# EAGLE design mk-logic-bt (EAGLE 6.0)

## Sheet 1 of 3
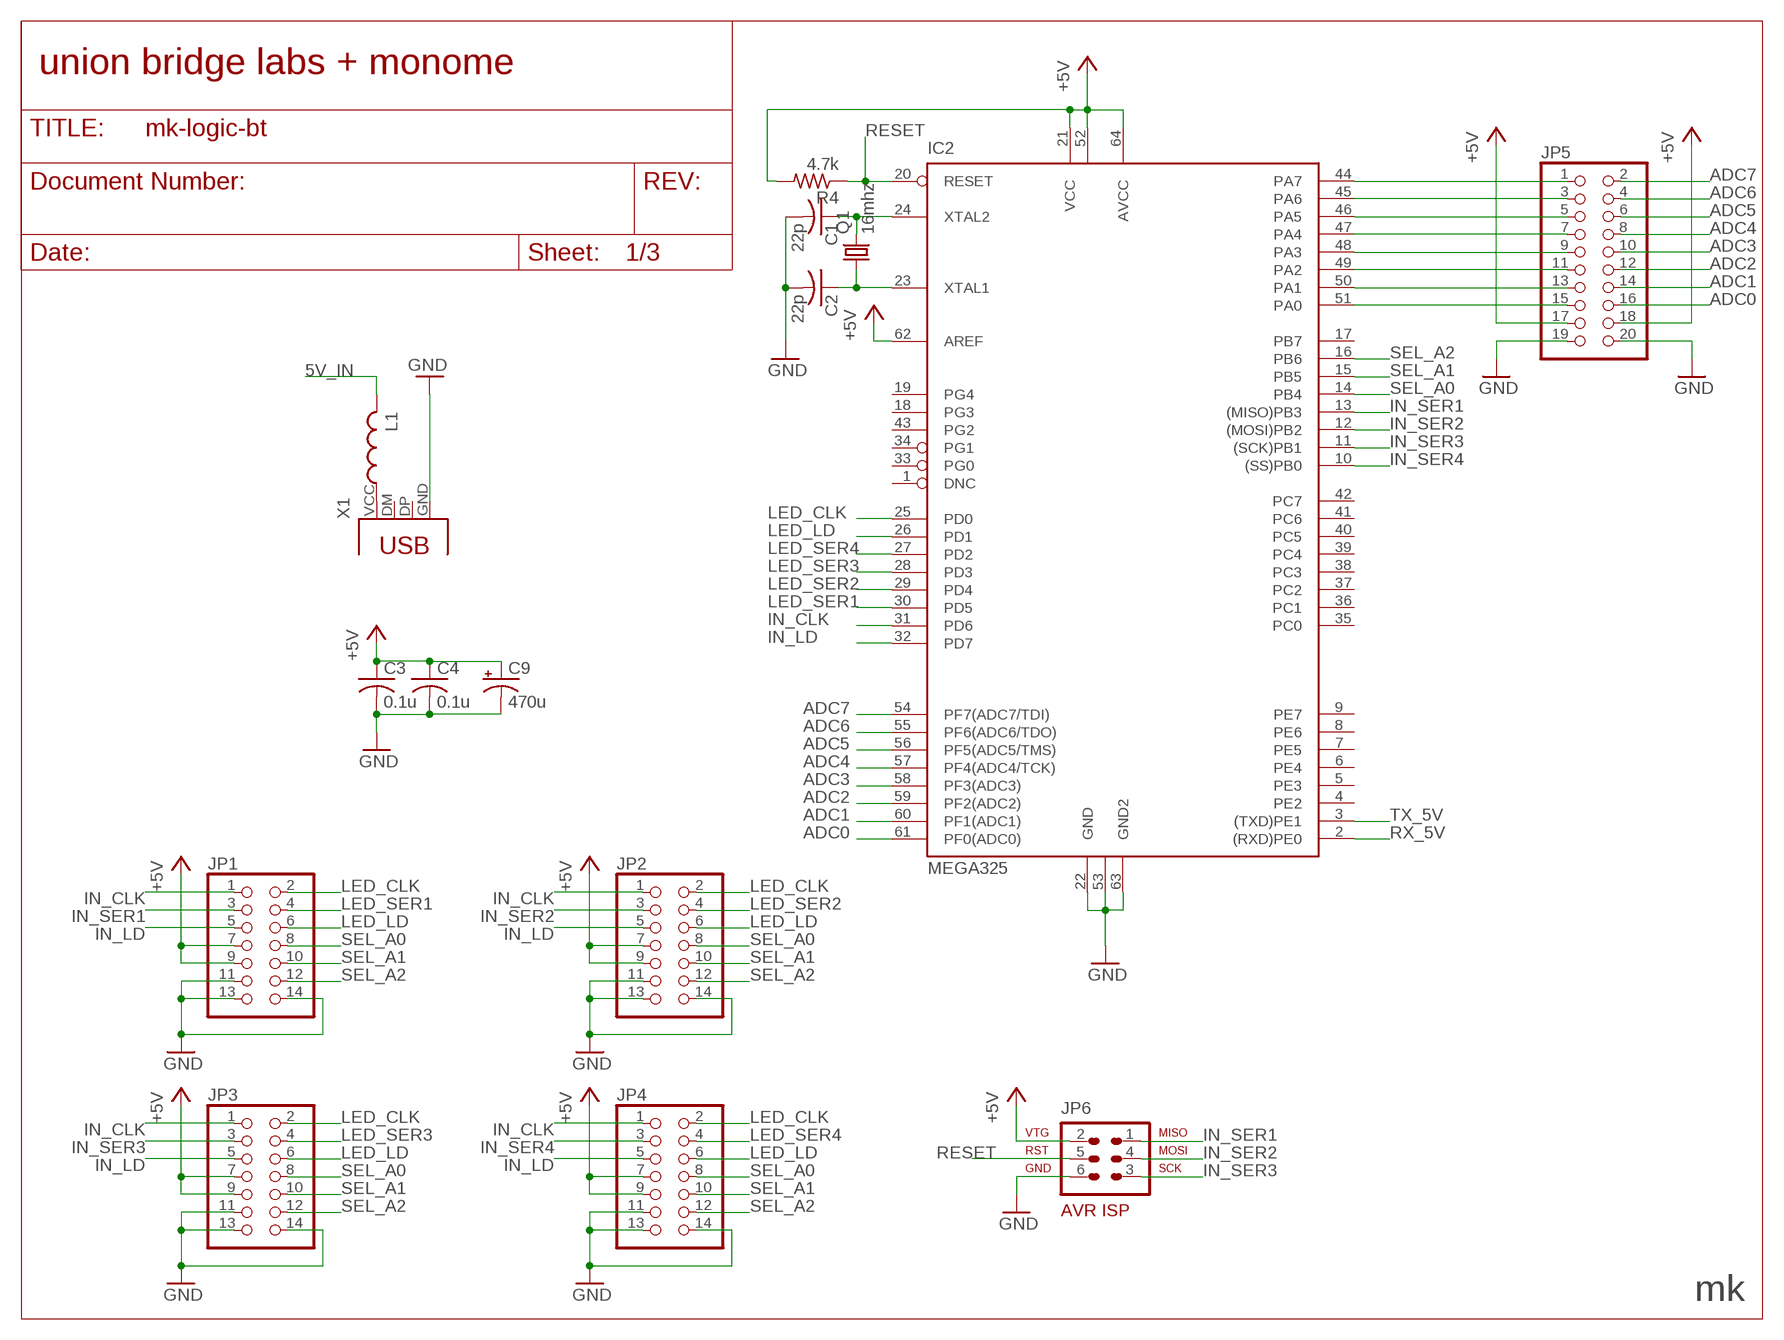
[diagram p0: schematic, sheet 1]

### Parts
C1  22p  C-USC1206  [C1206]
C2  22p  C-USC1206  [C1206]
C3  0.1u  C-USC1206  [C1206]
C4  0.1u  C-USC1206  [C1206]
C9  470u  CPOL-USE  [PANASONIC_E]
IC2  MEGA325  [TQFP64]
JP1  PINHD-2X7  [2X07]
JP2  PINHD-2X7  [2X07]
JP3  PINHD-2X7  [2X07]
JP4  PINHD-2X7  [2X07]
JP5  PINHD-2X10  [2X10]
JP6  AVR-ISP  AVR-ISP-6  [AVR-ISP-6]
L1  L-USL3216C  [L3216C]
Q1  16mhz  CRYTALHC49UP  [HC49UP]
R4  4.7k  R-US_R1206  [R1206]
X1  USB_TYPE_B  [USB_B]

### Nets
5V_IN: L1.2 ; also sheet 3
+5V: C3.1 C4.1 C9.+ IC2.21(VCC) IC2.52(VCC1) IC2.62(AREF) IC2.64(AVCC) JP1.7 JP1.9 JP2.7 JP2.9 JP3.7 JP3.9 JP4.7 JP4.9 JP5.17 JP5.18 JP6.2 R4.2 ; also sheet 2,3
ADC0: IC2.61(PF0(ADC0)) JP5.16
ADC1: IC2.60(PF1(ADC1)) JP5.14
ADC2: IC2.59(PF2(ADC2)) JP5.12
ADC3: IC2.58(PF3(ADC3)) JP5.10
ADC4: IC2.57(PF4(ADC4/TCK)) JP5.8
ADC5: IC2.56(PF5(ADC5/TMS)) JP5.6
ADC6: IC2.55(PF6(ADC6/TDO)) JP5.4
ADC7: IC2.54(PF7(ADC7/TDI)) JP5.2
GND: C1.2 C2.2 C3.2 C4.2 C9.- IC2.22(GND) IC2.53(GND1) IC2.63(GND2) JP1.11 JP1.13 JP1.14 JP2.11 JP2.13 JP2.14 JP3.11 JP3.13 JP3.14 JP4.11 JP4.13 JP4.14 JP5.19 JP5.20 JP6.6 X1.GND ; also sheet 2,3
IN_CLK: IC2.31(PD6) JP1.1 JP2.1 JP3.1 JP4.1
IN_LD: IC2.32(PD7) JP1.5 JP2.5 JP3.5 JP4.5
IN_SER1: IC2.13((MISO)PB3) JP1.3 JP6.1
IN_SER2: IC2.12((MOSI)PB2) JP2.3 JP6.4
IN_SER3: IC2.11((SCK)PB1) JP3.3 JP6.3
IN_SER4: IC2.10((SS)PB0) JP4.3
LED_CLK: IC2.25(PD0) JP1.2 JP2.2 JP3.2 JP4.2
LED_LD: IC2.26(PD1) JP1.6 JP2.6 JP3.6 JP4.6
LED_SER1: IC2.30(PD5) JP1.4
LED_SER2: IC2.29(PD4) JP2.4
LED_SER3: IC2.28(PD3) JP3.4
LED_SER4: IC2.27(PD2) JP4.4
N$4: IC2.44(PA7) JP5.1
N$5: IC2.45(PA6) JP5.3
N$6: IC2.46(PA5) JP5.5
N$7: IC2.47(PA4) JP5.7
N$8: C2.1 IC2.23(XTAL1) Q1.1
N$9: C1.1 IC2.24(XTAL2) Q1.2
N$10: IC2.48(PA3) JP5.9
N$11: IC2.49(PA2) JP5.11
N$12: L1.1 X1.VCC
N$23: IC2.50(PA1) JP5.13
N$24: IC2.51(PA0) JP5.15
RESET: IC2.20(RESET) JP6.5 R4.1
RX_5V: IC2.2((RXD)PE0) ; also sheet 2
SEL_A0: IC2.14(PB4) JP1.8 JP2.8 JP3.8 JP4.8
SEL_A1: IC2.15(PB5) JP1.10 JP2.10 JP3.10 JP4.10
SEL_A2: IC2.16(PB6) JP1.12 JP2.12 JP3.12 JP4.12
TX_5V: IC2.3((TXD)PE1) ; also sheet 2
Unconnected: IC2.1(DNC) IC2.4(PE2) IC2.5(PE3) IC2.6(PE4) IC2.7(PE5) IC2.8(PE6) IC2.9(PE7) IC2.17(PB7) IC2.18(PG3) IC2.19(PG4) IC2.33(PG0) IC2.34(PG1) IC2.35(PC0) IC2.36(PC1) IC2.37(PC2) IC2.38(PC3) IC2.39(PC4) IC2.40(PC5) IC2.41(PC6) IC2.42(PC7) IC2.43(PG2) X1.DM(USBDM) X1.DP(USBDP)

### Notes on the sheet
- union bridge labs + monome
- mk

## Sheet 2 of 3
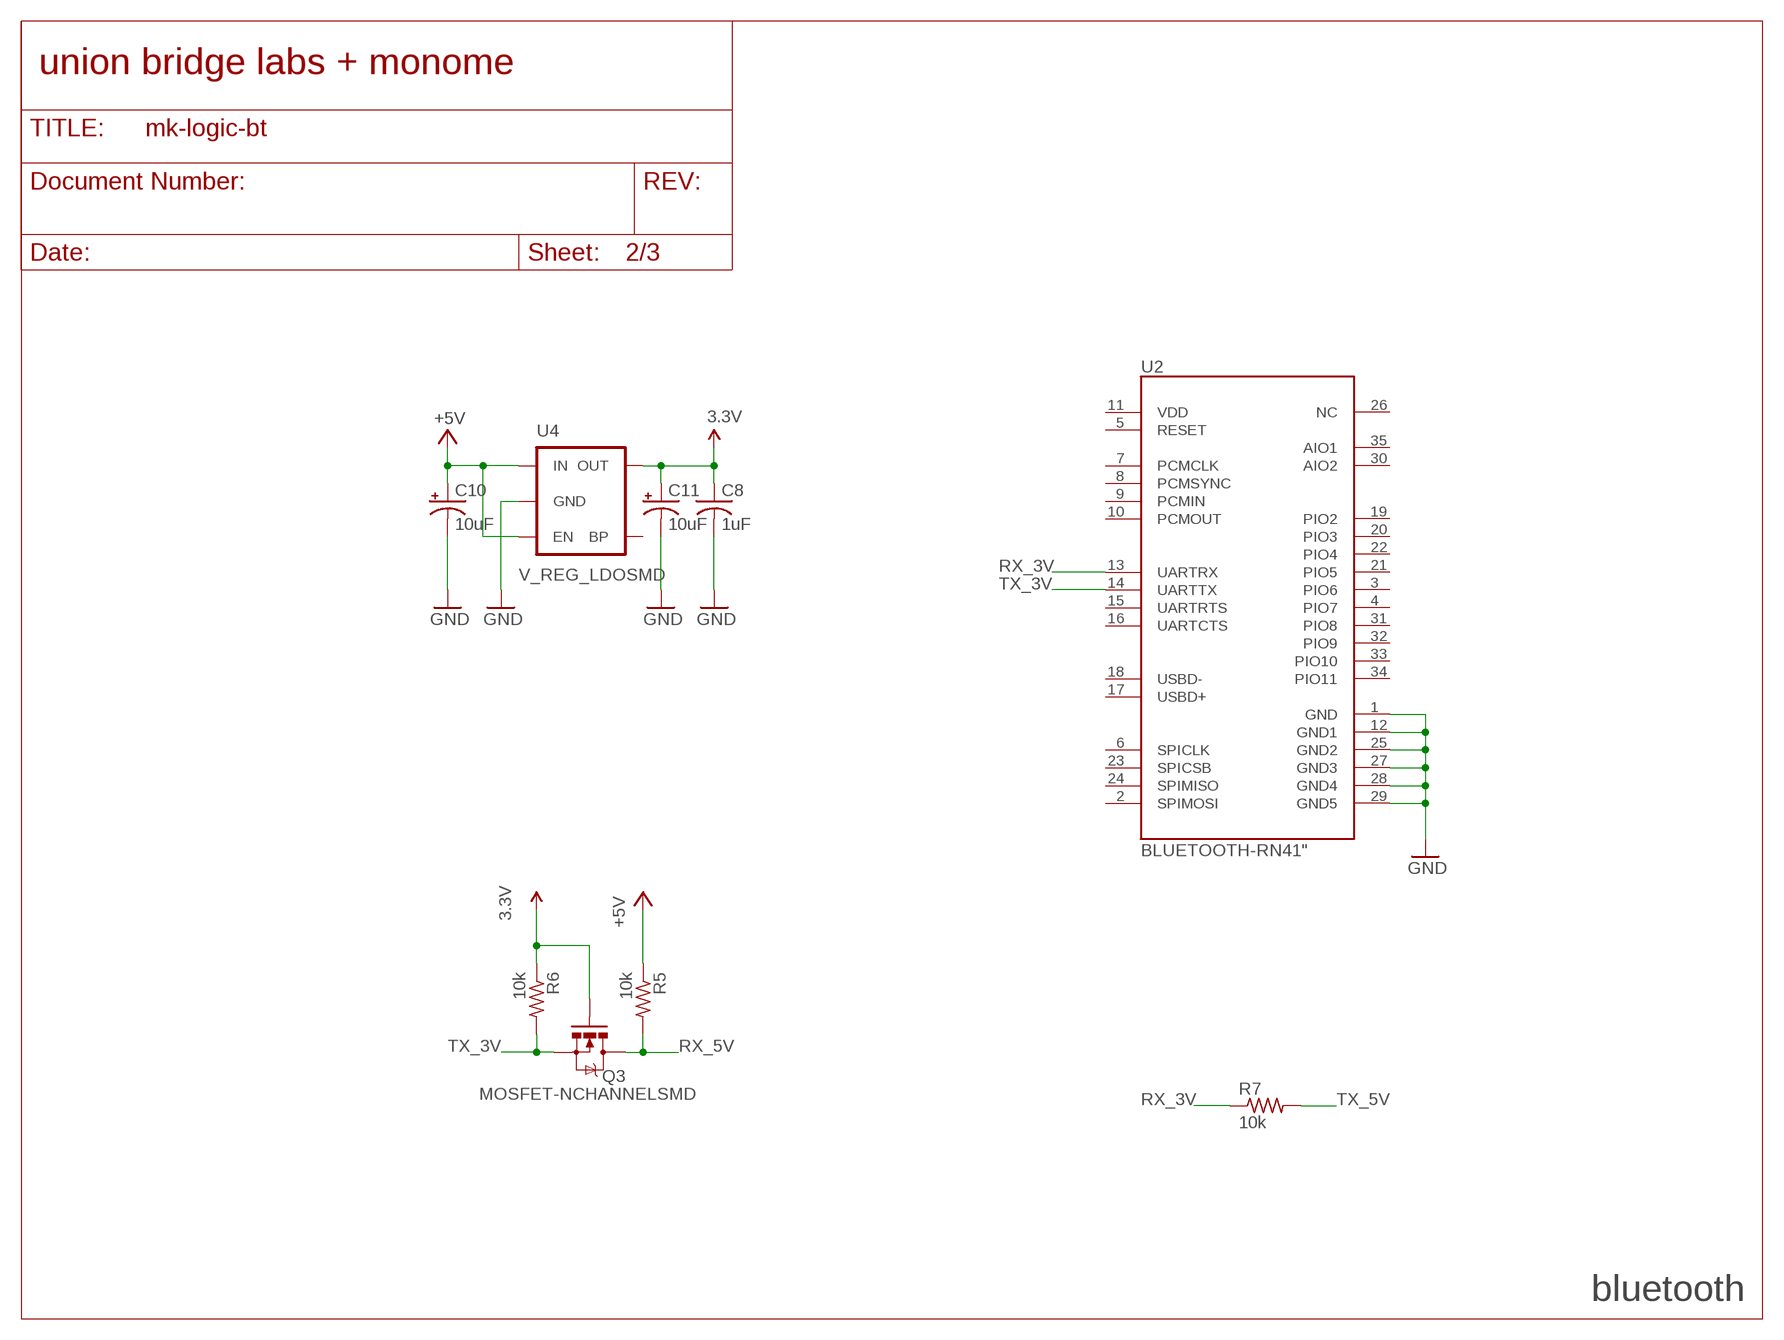
[diagram p1: schematic, sheet 2]

### Parts
C8  1uF  C-USC1206  [C1206]
C10  10uF  CAP_POL1206  [EIA3216]
C11  10uF  CAP_POL1206  [EIA3216]
Q3  MOSFET-NCHANNELSMD  [SOT23-3]
R5  10k  R-US_R1206  [R1206]
R6  10k  R-US_R1206  [R1206]
R7  10k  R-US_R1206  [R1206]
U2  BLUETOOTH-RN41"  [RN41]
U4  V_REG_LDOSMD  [SOT23-5]

### Nets
3.3V: C8.1 C11.A(+) Q3.1(G) R6.1 U4.5(OUT)
+5V: C10.A(+) R5.1 U4.1(IN) U4.3(EN) ; also sheet 1,3
GND: C8.2 C10.C(-) C11.C(-) U2.1(GND) U2.12(GND1) U2.25(GND2) U2.27(GND3) U2.28(GND4) U2.29(GND5) U4.2(GND) ; also sheet 1,3
RX_3V: R7.1 U2.13(UARTRX)
RX_5V: Q3.3(D) R5.2 ; also sheet 1
TX_3V: Q3.2(S) R6.2 U2.14(UARTTX)
TX_5V: R7.2 ; also sheet 1
Unconnected: U2.2(SPIMOSI) U2.3(PIO6) U2.4(PIO7) U2.5(RESET) U2.6(SPICLK) U2.7(PCMCLK) U2.8(PCMSYNC) U2.9(PCMIN) U2.10(PCMOUT) U2.11(VDD) U2.15(UARTRTS) U2.16(UARTCTS) U2.17(USBD+) U2.18(USBD-) U2.19(PIO2) U2.20(PIO3) U2.21(PIO5) U2.22(PIO4) U2.23(SPICSB) U2.24(SPIMISO) U2.26(NC) U2.30(AIO2) U2.31(PIO8) U2.32(PIO9) U2.33(PIO10) U2.34(PIO11) U2.35(AIO1) U4.4(BP)

### Notes on the sheet
- union bridge labs + monome
- bluetooth

## Sheet 3 of 3
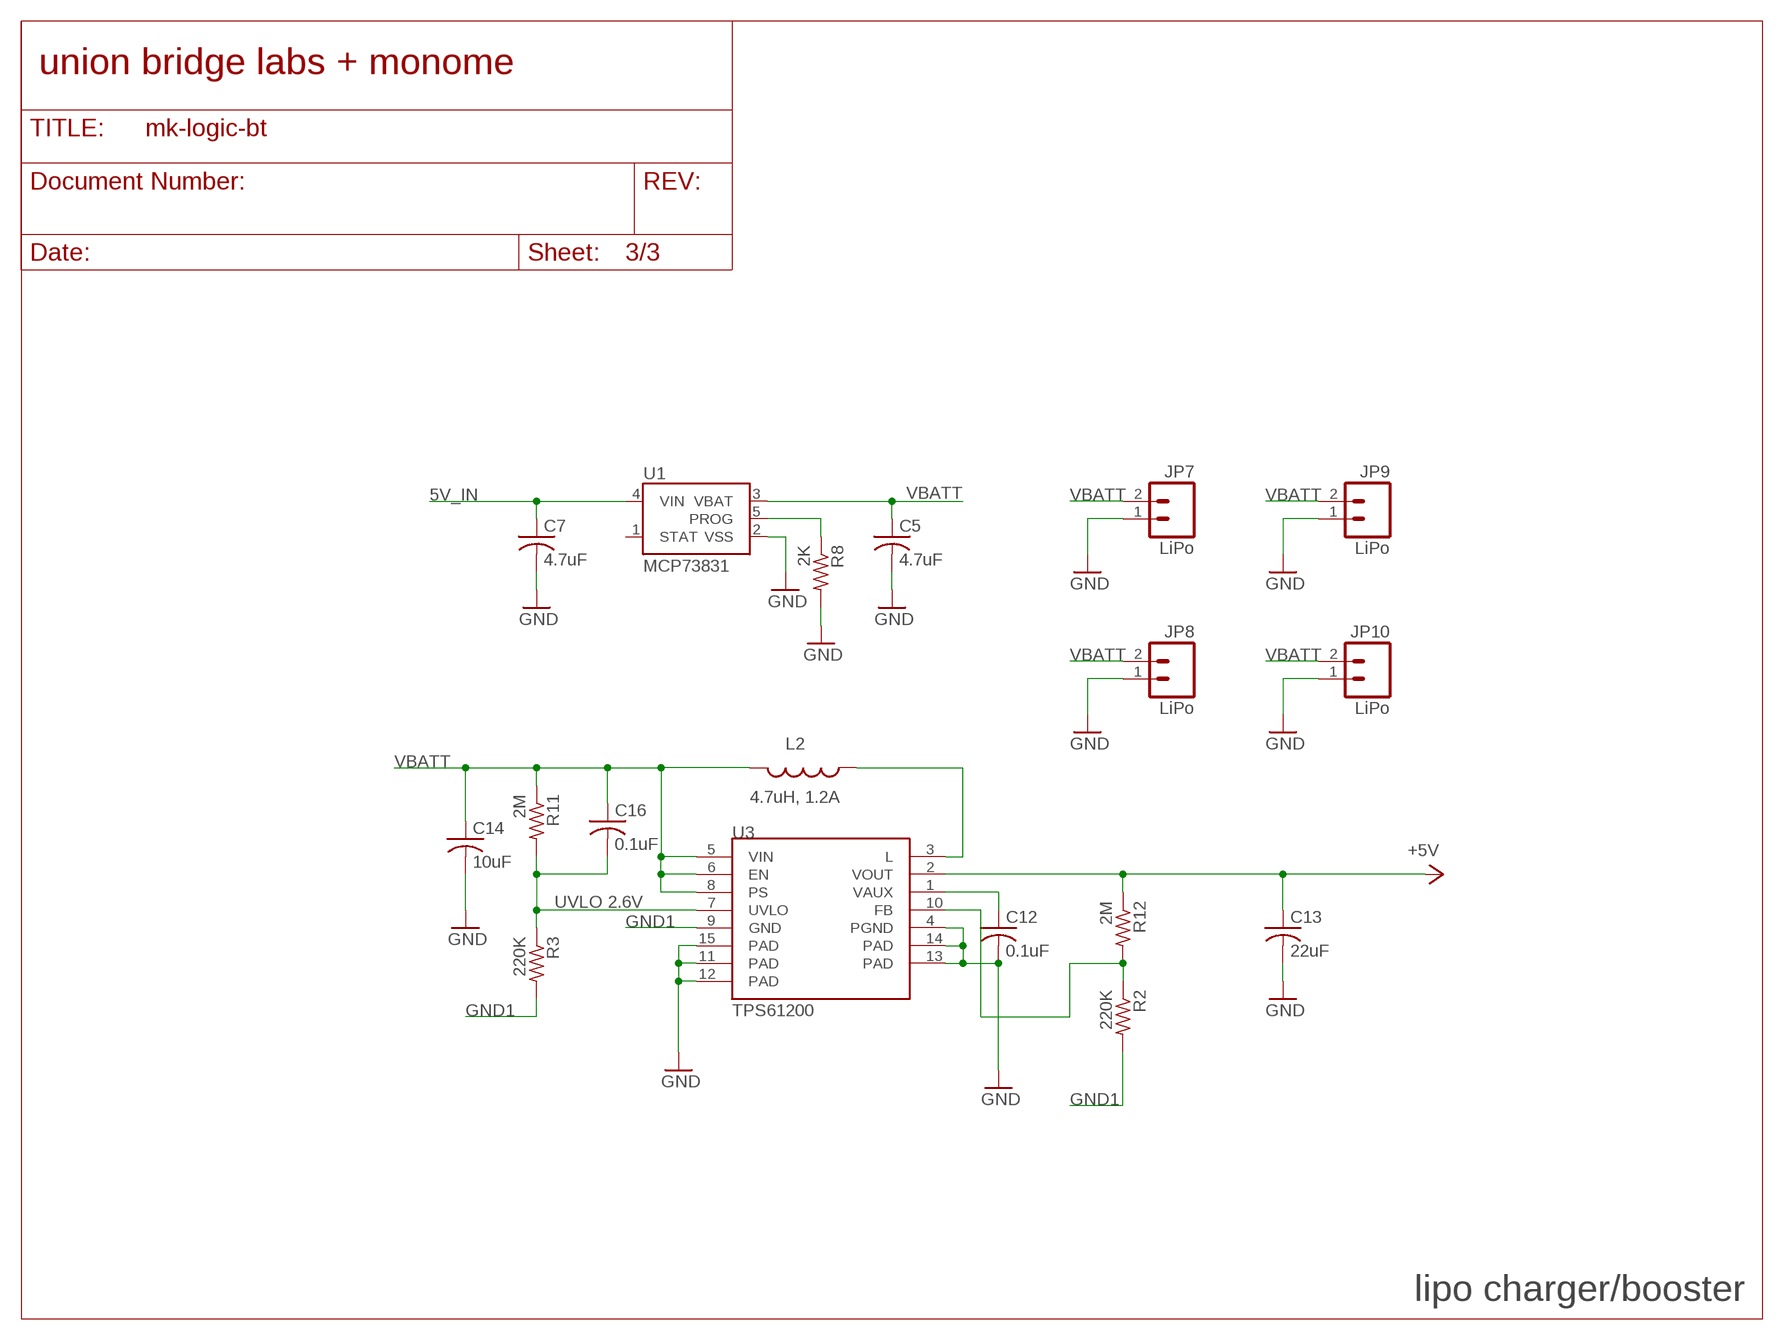
[diagram p2: schematic, sheet 3]

### Parts
C5  4.7uF  C-USC1206  [C1206]
C7  4.7uF  C-USC1206  [C1206]
C12  0.1uF  C-USC1206  [C1206]
C13  22uF  C-USC1206  [C1206]
C14  10uF  C-USC1206  [C1206]
C16  0.1uF  C-USC1206  [C1206]
JP7  LiPo  M02-JST-2MM-SMT  [JST-2-SMD]
JP8  LiPo  M02-JST-2MM-SMT  [JST-2-SMD]
JP9  LiPo  M02-JST-2MM-SMT  [JST-2-SMD]
JP10  LiPo  M02-JST-2MM-SMT  [JST-2-SMD]
L2  4.7uH, 1.2A  INDUCTOR.  [CDRH2D09]
R2  220K  R-US_R1206  [R1206]
R3  220K  R-US_R1206  [R1206]
R8  2K  R-US_R1206  [R1206]
R11  2M  R-US_R1206  [R1206]
R12  2M  R-US_R1206  [R1206]
U1  MCP73831  [SOT23-5]
U3  TPS61200  [QFN-10_PAD]

### Nets
5V_IN: C7.1 U1.4(VIN) ; also sheet 1
+5V: C13.1 R12.1 U3.2(VOUT) ; also sheet 1,2
GND: C5.2 C7.2 C12.2 C13.2 C14.2 JP7.1 JP8.1 JP9.1 JP10.1 R8.2 U1.2(VSS) U3.4(PGND) U3.11(PAD) U3.12(PAD) U3.13(PAD) U3.14(PAD) U3.15(PAD) ; also sheet 1,2
GND1: R2.2 R3.2 U3.9(GND)
N$1: R8.1 U1.5(PROG)
N$2: L2.P$1 U3.3(L)
N$3: C12.1 U3.1(VAUX)
N$13: R2.1 R12.2 U3.10(FB)
UVLO: C16.2 R3.1 R11.2 U3.7(UVLO)
VBATT: C5.1 C14.1 C16.1 JP7.2 JP8.2 JP9.2 JP10.2 L2.P$2 R11.1 U1.3(VBAT) U3.5(VIN) U3.6(EN) U3.8(PS)
Unconnected: U1.1(STAT)

### Notes on the sheet
- union bridge labs + monome
- UVLO 2.6V
- lipo charger/booster

## Library data of the parts
C1-C5 C7 C8 C12-C14 C16 = rcl:C-US: CAPACITOR, American symbol
C9 = rcl:CPOL-US: POLARIZED CAPACITOR, American symbol
C10 C11 = SparkFun:CAP_POL: Capacitor Polarized These are standard SMD and PTH capacitors. Normally 10uF, 47uF, and 100uF in electrolytic and tantalum varieties. Always verify the external diameter of the through hole cap, it varies with capacity, voltage, and manufacturer. The EIA devices should be standard.
IC2 = monome:MEGA325
JP1-JP4 = pinhead:PINHD-2X7: PIN HEADER
JP5 = pinhead:PINHD-2X10: PIN HEADER
JP6 = monome:AVR-ISP-6: AVR ISP-6 Serial Programming Header
JP7-JP10 = SparkFun:M02: Header 2 Standard 2-pin 0.1" header. Use with straight break away headers (SKU : PRT-00116), right angle break away headers (PRT-00553), swiss pins (PRT-00743), machine pins (PRT-00117), and female headers (PRT-00115). Molex polarized connector foot print use with SKU : PRT-08233 with associated crimp pins and housings.
L1 = rcl:L-US: INDUCTOR, American symbol
L2 = SparkFun:INDUCTOR: Inductors Basic Inductor/Choke - 0603 and 1206. Footprints are not proven and vary greatly between part numbers.
Q1 = crystal:CRYTAL: CRYSTAL
Q3 = SparkFun:MOSFET-NCHANNEL
R2-R8 R11 R12 = rcl:R-US_: RESISTOR, American symbol
U1 = SparkFun:MCP73831: Microchip's MCP73831 Miniature single cell, fully integrated Li-Ion, Li-polymer charge management controller http://ww1.microchip.com/downloads/en/DeviceDoc/21984a.pdf
U2 = SparkFun:BLUETOOTH-RN41
U3 = SparkFun:TPS61200: DC to DC Booster
U4 = SparkFun:V_REG_LDO: Voltage Regulator LDO Standard 150mA LDO voltage regulator in SOT-23 layout. Micrel part MIC5205. BP (by-pass) pin is used to lower output noise with 470pF cap.
X1 = monome:USB_TYPE_B: BERG USB connector

## Board
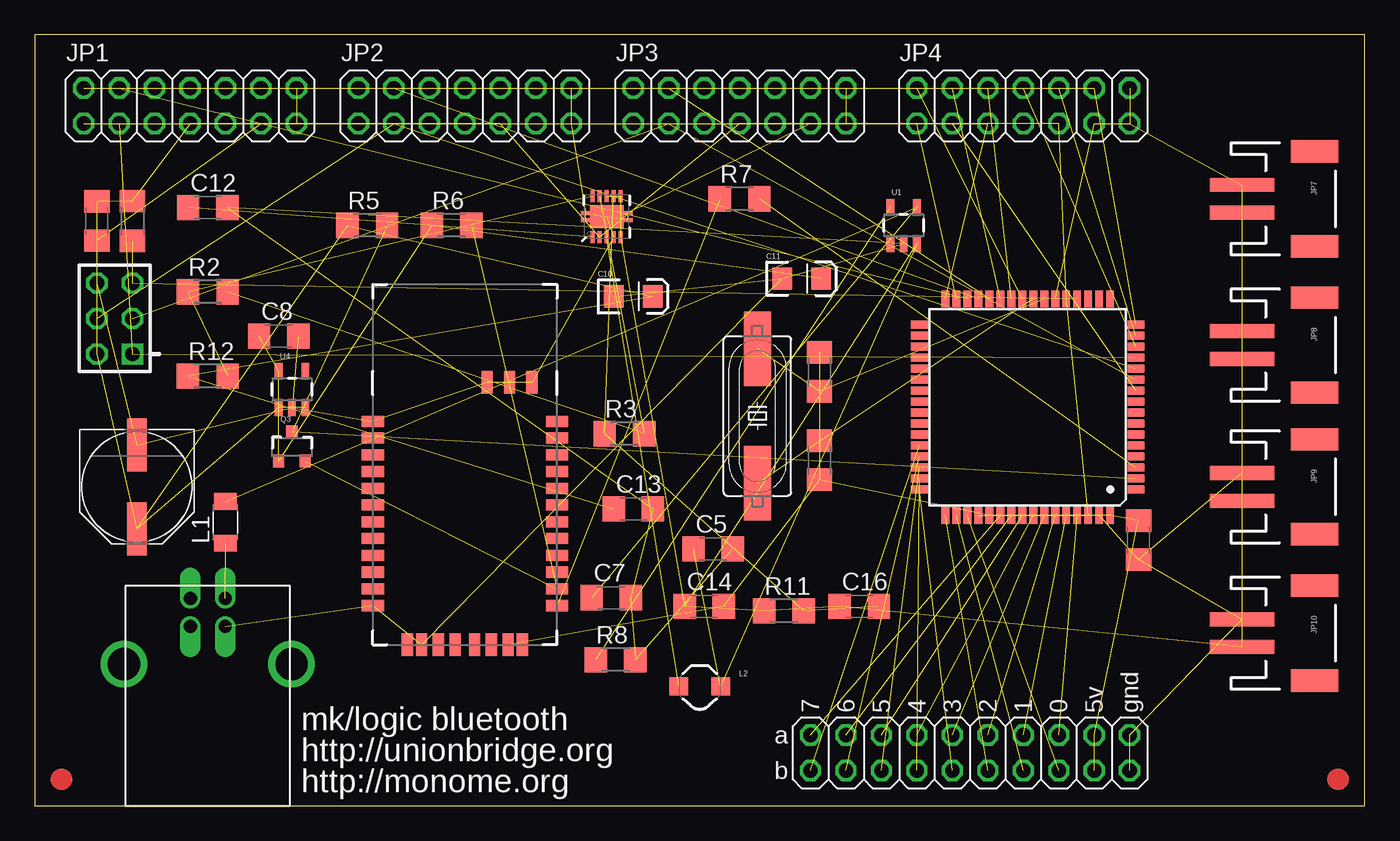
[diagram p3: board, top side]
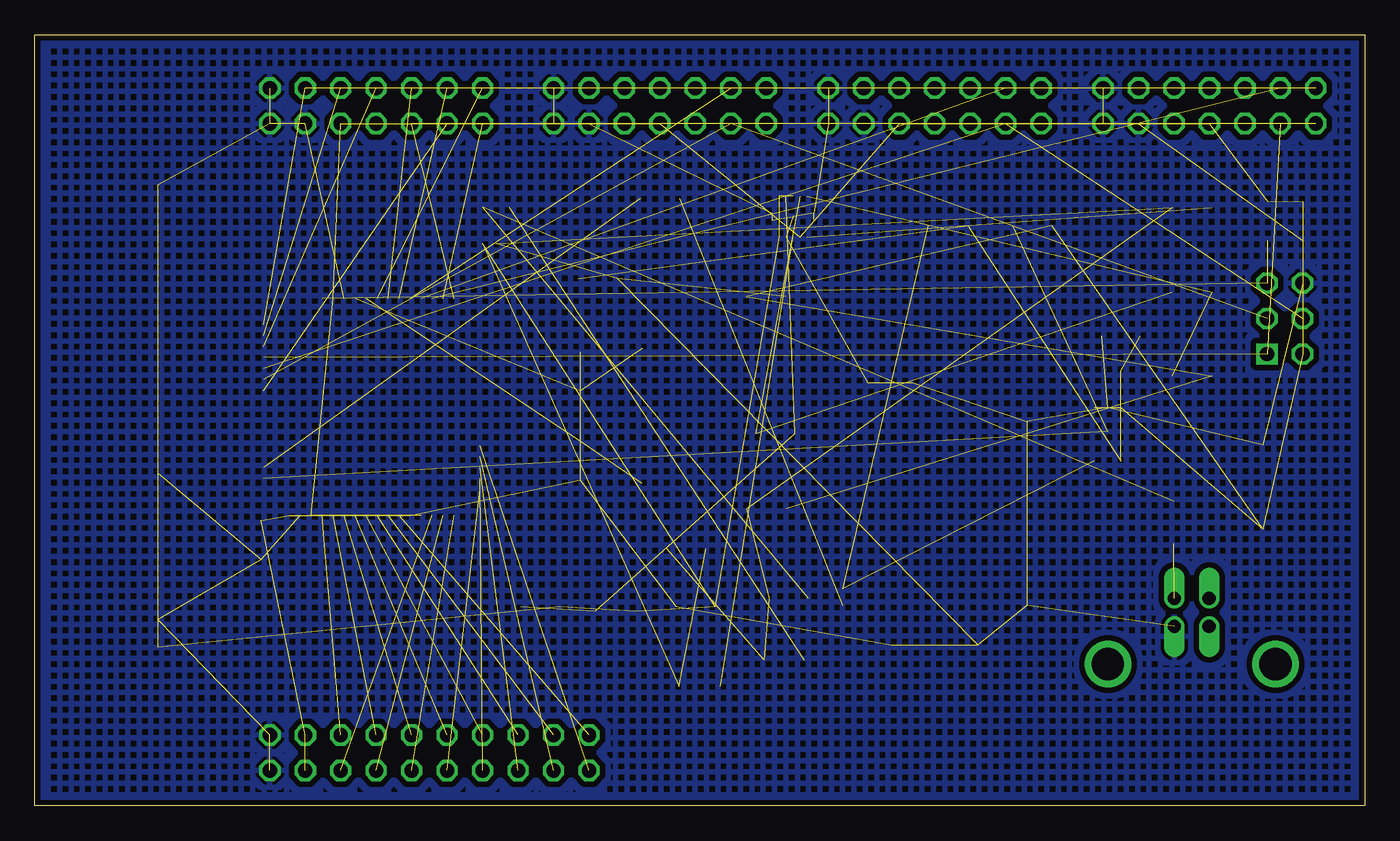
[diagram p4: board, bottom side, seen from below]

Size 95.25 x 55.24 mm. Coordinates in mm from the lower left corner, seen from the top.
Outline: 0,0 95.25,0 95.25,55.24 0,55.24 0,0
Copper layers (1+16): Top 0.035mm / dielectric 1.5mm / Bottom 0.035mm
Design rules: minimum track width 10mil, minimum drill 12mil, track to track 8mil, track to pad 8mil, pad to pad 8mil, via to via 8mil, smd to smd 8mil, copper to edge 10mil, drill to drill 8mil, minimum pad ring 10mil, minimum via ring 8mil, stop-mask expansion 4mil, vias tented up to drill 0mil, thermal gap 10mil

### Footprints (pad centres in the part's own frame; a part is rotated, then mirrored left to right if it is on the bottom)
C1206 = smd 1.6 x 1.8: 1 -1.4,0; 2 1.4,0
PANASONIC_E = smd 3.8 x 1.4: + 3,0; - -3,0
EIA3216 = smd 1.4 x 1.6: A 1.4,0; C -1.4,0
TQFP64 = smd 1.194 x 0.559: 1 -7.76,5.905; 2 -7.76,5.118; 3 -7.76,4.331; 4 -7.76,3.543; 5 -7.76,2.756; 6 -7.76,1.968; 7 -7.76,1.181; 8 -7.76,0.394; 9 -7.76,-0.394; 10 -7.76,-1.181; 11 -7.76,-1.968; 12 -7.76,-2.756; 13 -7.76,-3.543; 14 -7.76,-4.331; 15 -7.76,-5.118; 16 -7.76,-5.905; 33 7.76,-5.905; 34 7.76,-5.118; 35 7.76,-4.331; 36 7.76,-3.543; 37 7.76,-2.756; 38 7.76,-1.968; 39 7.76,-1.181; 40 7.76,-0.394; 41 7.76,0.394; 42 7.76,1.181; 43 7.76,1.968; 44 7.76,2.756; 45 7.76,3.543; 46 7.76,4.331; 47 7.76,5.118; 48 7.76,5.905 | smd 0.559 x 1.194: 17 -5.905,-7.76; 18 -5.118,-7.76; 19 -4.331,-7.76; 20 -3.543,-7.76; 21 -2.756,-7.76; 22 -1.968,-7.76; 23 -1.181,-7.76; 24 -0.394,-7.76; 25 0.394,-7.76; 26 1.181,-7.76; 27 1.968,-7.76; 28 2.756,-7.76; 29 3.543,-7.76; 30 4.331,-7.76; 31 5.118,-7.76; 32 5.905,-7.76; 49 5.905,7.76; 50 5.118,7.76; 51 4.331,7.76; 52 3.543,7.76; 53 2.756,7.76; 54 1.968,7.76; 55 1.181,7.76; 56 0.394,7.76; 57 -0.394,7.76; 58 -1.181,7.76; 59 -1.968,7.76; 60 -2.756,7.76; 61 -3.543,7.76; 62 -4.331,7.76; 63 -5.118,7.76; 64 -5.905,7.76
2X07 = drill 1.016 octagon: 1 -7.62,-1.27; 2 -7.62,1.27; 3 -5.08,-1.27; 4 -5.08,1.27; 5 -2.54,-1.27; 6 -2.54,1.27; 7 0,-1.27; 8 0,1.27; 9 2.54,-1.27; 10 2.54,1.27; 11 5.08,-1.27; 12 5.08,1.27; 13 7.62,-1.27; 14 7.62,1.27
2X10 = drill 1.016 octagon: 1 -11.43,-1.27; 2 -11.43,1.27; 3 -8.89,-1.27; 4 -8.89,1.27; 5 -6.35,-1.27; 6 -6.35,1.27; 7 -3.81,-1.27; 8 -3.81,1.27; 9 -1.27,-1.27; 10 -1.27,1.27; 11 1.27,-1.27; 12 1.27,1.27; 13 3.81,-1.27; 14 3.81,1.27; 15 6.35,-1.27; 16 6.35,1.27; 17 8.89,-1.27; 18 8.89,1.27; 19 11.43,-1.27; 20 11.43,1.27
AVR-ISP-6 = drill 1.016 square: 1 -2.54,-1.27 | drill 1.016 octagon: 2 -2.54,1.27; 3 0,-1.27; 4 0,1.27; 5 2.54,-1.27; 6 2.54,1.27
JST-2-SMD = smd 1 x 4.6: 1 -1,-3.7; 2 1,-3.7 | smd 1.6 x 3.4: NC1 -3.4,1.5; NC2 3.4,1.5
L3216C = smd 1.2 x 1.6: 1 -1.5,0; 2 1.5,0
CDRH2D09 = smd 1.3 x 1.3: P$1 -1.5,0; P$2 1.5,0
HC49UP = smd 5.334 x 1.93: 1 -4.826,0; 2 4.826,0
SOT23-3 = smd 0.8 x 0.9: 1 -0.95,-1; 2 0.95,-1; 3 0,1.1
R1206 = smd 1.6 x 1.803: 1 -1.422,0; 2 1.422,0
SOT23-5 = smd 0.55 x 1.2: 1 -0.95,-1.3; 2 0,-1.3; 3 0.95,-1.3; 4 0.95,1.3; 5 -0.95,1.3
RN41 = smd 0.8 x 1.6: 1 -6.6,-6.6; 2 -5.4,-6.6; 3 -4.2,-6.6; 4 -3,-6.6; 5 -1.8,-6.6; 6 -0.6,-6.6; 7 0.6,-6.6; 8 1.8,-6.6; 9 3,-6.6; 10 4.2,-6.6; 11 5.4,-6.6; 12 6.6,-6.6; 13 6.6,6.6; 14 5.4,6.6; 15 4.2,6.6; 16 3,6.6; 17 1.8,6.6; 18 0.6,6.6; 19 -0.6,6.6; 20 -1.8,6.6; 21 -3,6.6; 22 -4.2,6.6; 23 -5.4,6.6; 24 -6.6,6.6 | smd 1.6 x 0.8: 25 -9.4,4.8; 26 -9.4,3.2; 27 -9.4,1.6; 28 9.4,3.1; 29 9.4,-3.1; 30 9.4,-4.122; 31 9.4,-1.9; 32 9.4,-0.7; 33 9.4,0.7; 34 9.4,1.9; 35 9.4,4.122
QFN-10_PAD = smd 0.297 x 0.85: 1 -1,-1.475; 2 -0.5,-1.475; 3 0,-1.475; 4 0.5,-1.475; 5 1,-1.475; 6 1,1.475; 7 0.5,1.475; 8 0,1.475; 9 -0.5,1.475; 10 -1,1.475 | smd 0.7 x 0.28: 11 -1.5,0.25; 12 -1.5,-0.25; 13 1.5,0.25; 14 1.5,-0.25 | smd 2.4 x 1.65: 15 0,0
USB_B = drill 0.95 offset: DM -1.25,4.71; DP -1.25,2.71; GND 1.25,2.71; VCC 1.25,4.71 | drill 2.3: MOUNT1 -6,0; MOUNT2 6,0

### Placement (x,y rotation side)
C1  56.2,24.77 270 top
C2  56.2,31.11 90 top
C3  79.06,19.05 270 top
C4  4.45,41.91 270 top
C5  48.58,18.41 0 top
C7  41.27,14.92 0 top
C8  17.46,33.66 0 top
C9  7.3,22.86 270 top
C10  42.86,36.51 0 top
C11  54.93,37.78 0 top
C12  12.38,42.86 0 top
C13  42.86,21.27 0 top
C14  47.94,14.29 0 top
C16  59.05,14.29 0 top
IC2  71.12,28.57 180 top
JP1  11.11,50.16 0 top
JP2  30.8,50.16 0 top
JP3  50.48,50.16 0 top
JP4  70.8,50.16 0 top
JP5  66.99,3.81 0 top
JP6  5.71,34.92 90 top
JP7  90.17,43.5 270 top
JP8  90.17,33.02 270 top
JP9  90.17,22.86 270 top
JP10  90.17,12.38 270 top
L1  13.65,20.32 90 top
L2  47.62,8.57 0 top
Q1  51.75,27.94 270 top
Q3  18.41,25.72 0 top
R2  12.38,36.83 0 top
R3  42.23,26.67 0 top
R4  6.99,41.91 90 top
R5  23.81,41.59 0 top
R6  29.84,41.59 0 top
R7  50.48,43.5 0 top
R8  41.59,10.48 0 top
R11  53.66,13.97 0 top
R12  12.38,30.8 0 top
U1  62.23,41.59 0 top
U2  30.8,20.95 270 top
U3  40.96,42.23 0 top
U4  18.41,29.84 0 top
U6  [FEDUCIAL]  1.91,1.91 0 top
U7  [FEDUCIAL]  93.34,1.91 0 top
X1  12.38,10.16 0 top

### Tracks (layer width: path | path; a pad name or v marks a point on that pad's centre or on a via)
3.3V  (4 unrouted)
5V_IN  (2 unrouted)
+5V  (25 unrouted)
ADC0  (1 unrouted)
ADC1  (1 unrouted)
ADC2  (1 unrouted)
ADC3  (1 unrouted)
ADC4  (1 unrouted)
ADC5  (1 unrouted)
ADC6  (1 unrouted)
ADC7  (1 unrouted)
GND  (50 unrouted)
  pour Bottom (isolate 0.406, hatched): 0,0 0,55.24 95.25,55.24 95.25,0
GND1  (2 unrouted)
IN_CLK  (4 unrouted)
IN_LD  (4 unrouted)
IN_SER1  (2 unrouted)
IN_SER2  (2 unrouted)
IN_SER3  (2 unrouted)
IN_SER4  (1 unrouted)
LED_CLK  (4 unrouted)
LED_LD  (4 unrouted)
LED_SER1  (1 unrouted)
LED_SER2  (1 unrouted)
LED_SER3  (1 unrouted)
LED_SER4  (1 unrouted)
N$1  (1 unrouted)
N$2  (1 unrouted)
N$3  (1 unrouted)
N$4  (1 unrouted)
N$5  (1 unrouted)
N$6  (1 unrouted)
N$7  (1 unrouted)
N$8  (2 unrouted)
N$9  (2 unrouted)
N$10  (1 unrouted)
N$11  (1 unrouted)
N$12  (1 unrouted)
N$13  (2 unrouted)
N$23  (1 unrouted)
N$24  (1 unrouted)
RESET  (2 unrouted)
RX_3V  (1 unrouted)
RX_5V  (2 unrouted)
SEL_A0  (4 unrouted)
SEL_A1  (4 unrouted)
SEL_A2  (4 unrouted)
TX_3V  (2 unrouted)
TX_5V  (1 unrouted)
UVLO  (3 unrouted)
VBATT  (12 unrouted)

### Text on the board
tPlace: 7 | 6 | 5 | 4 | 3 | 2 | 1 | 0 | 5v | gnd | a | mk/logic bluetooth | http://unionbridge.org | b | http://monome.org